# Altium schematic sheet Sensors.SchDoc
size B; SheetNumber: 8; SheetTotal: 8
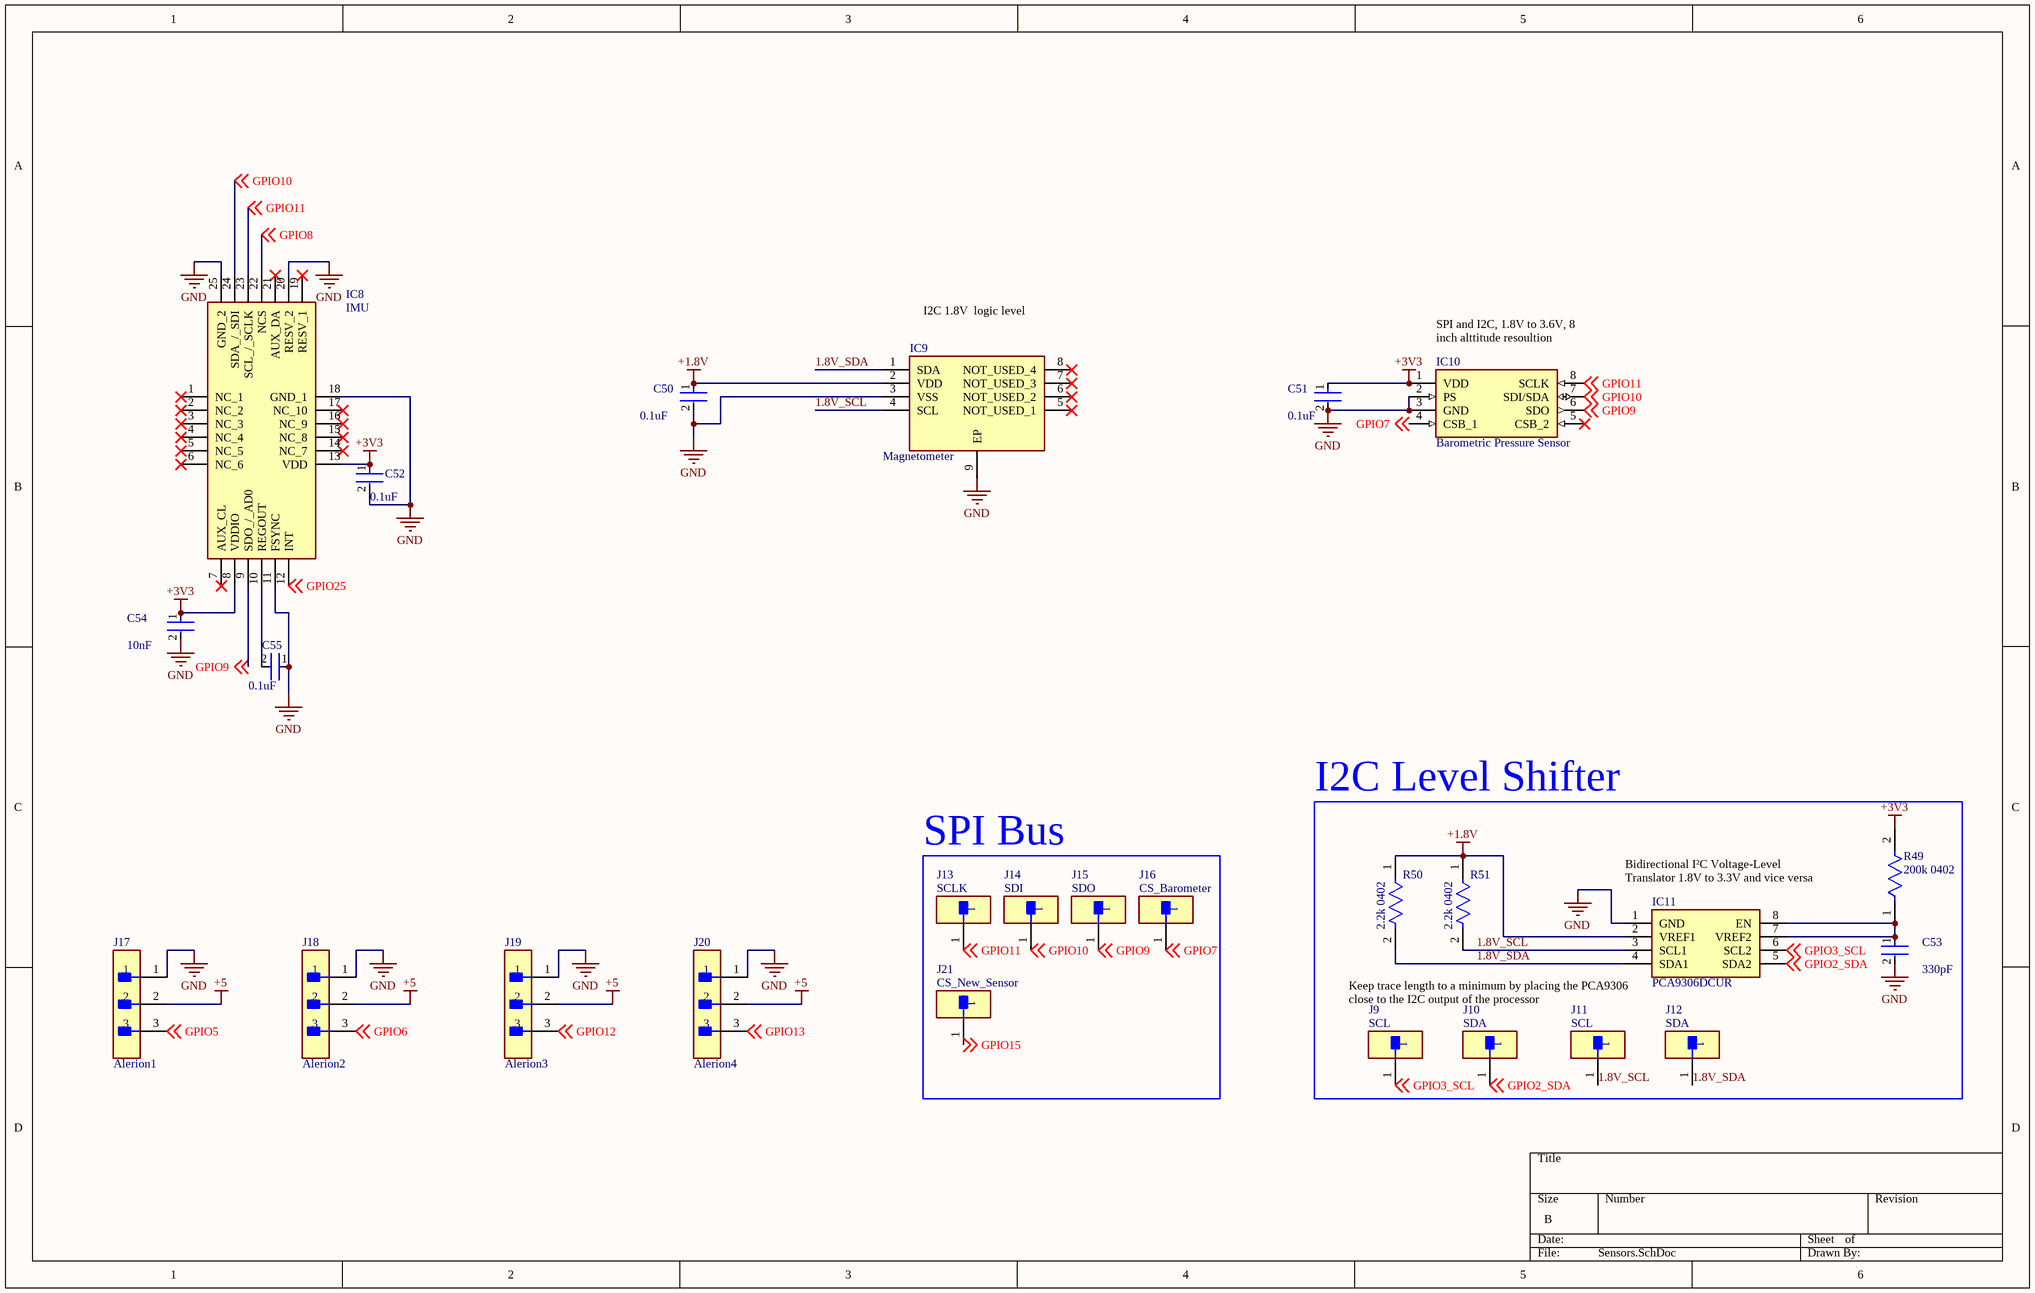
[diagram p0: Sensors.SchDoc]

## Parts
C50  0.1uF  [FP-C0402-BB-MFG]
C51  0.1uF  [FP-C0402-BB-MFG]
C52  0.1uF  [FP-C0402-BB-MFG]
C53  330pF  [FP-C0402-BB-MFG]
C54  10nF  [FP-C0402-BB-MFG]
C55  0.1uF  [FP-C0402-BB-MFG]
IC8  IMU  [QFN40P300X300X95-25N-D]
IC9  Magnetometer  [SON40P250X200X40-9N-D]
IC10  Barometric Pressure Sensor  [MS5607-02BA03]
IC11  PCA9306DCUR  [SOP50P310X90-8N]
J9  SCL  [FP-5015-MFG]
J10  SDA  [FP-5015-MFG]
J11  SCL  [FP-5015-MFG]
J12  SDA  [FP-5015-MFG]
J13  SCLK  [FP-5015-MFG]
J14  SDI  [FP-5015-MFG]
J15  SDO  [FP-5015-MFG]
J16  CS_Barometer  [FP-5015-MFG]
J17  Alerion1  [FP-TSW-103-14-G-S-MFG]
J18  Alerion2  [FP-TSW-103-14-G-S-MFG]
J19  Alerion3  [FP-TSW-103-14-G-S-MFG]
J20  Alerion4  [FP-TSW-103-14-G-S-MFG]
J21  CS_New_Sensor  [FP-5015-MFG]
R49  200k 0402  [FP-RMCF0402-MFG]
R50  2.2k 0402  [FP-RMCF0402-MFG]
R51  2.2k 0402  [FP-RMCF0402-MFG]

## Blocks framed on the sheet
I2C Level Shifter: C53 IC11 J9-J12 R49-R51
SPI Bus: J13-J16 J21

## Nets
+1.8V: C50.1 IC9.2(VDD) IC11.2(VREF1) R50.1 R51.1
+3V3: C51.1 C52.1 C54.1 IC8.8(VDDIO) IC8.13(VDD) IC10.1(VDD) R49.2
+5: J17.2 J18.2 J19.2 J20.2
GND: C50.2 C51.2 C52.2 C53.2 C54.2 C55.1 IC8.11(FSYNC) IC8.18(GND_1) IC8.20(RESV_2) IC8.25(GND_2) IC9.3(VSS) IC9.9(EP) IC10.2(PS) IC10.3(GND) IC11.1(GND) J17.1 J18.1 J19.1 J20.1
1.8V_SCL: IC9.4(SCL) IC11.3(SCL1) J11.1 R51.2
1.8V_SDA: IC9.1(SDA) IC11.4(SDA1) J12.1 R50.2
GPIO2_SDA: IC11.5(SDA2) J10.1 ; off-sheet GPIO2_SDA
GPIO3_SCL: IC11.6(SCL2) J9.1 ; off-sheet GPIO3_SCL
GPIO5: J17.3 ; off-sheet GPIO5
GPIO6: J18.3 ; off-sheet GPIO6
GPIO7: IC10.4(CSB_1) J16.1 ; off-sheet GPIO7
GPIO8: IC8.22(NCS) ; off-sheet GPIO8
GPIO9: IC8.9(SDO_/_AD0) IC10.6(SDO) J15.1 ; off-sheet GPIO9
GPIO10: IC8.24(SDA_/_SDI) IC10.7(SDI/SDA) J14.1 ; off-sheet GPIO10
GPIO11: IC8.23(SCL_/_SCLK) IC10.8(SCLK) J13.1 ; off-sheet GPIO11
GPIO12: J19.3 ; off-sheet GPIO12
GPIO13: J20.3 ; off-sheet GPIO13
GPIO15: J21.1 ; off-sheet GPIO15
GPIO25: IC8.12(INT) ; off-sheet GPIO25
NetC53_1: C53.1 IC11.7(VREF2) IC11.8(EN) R49.1
NetC55_2: C55.2 IC8.10(REGOUT)

Not connected (* = marked no-connect by the designer): IC8 1(NC_1)* 2(NC_2)* 3(NC_3)* 4(NC_4)* 5(NC_5)* 6(NC_6)* 7(AUX_CL)* 14(NC_7)* 15(NC_8)* 16(NC_9)* 17(NC_10)* 19(RESV_1)* 21(AUX_DA)*; IC9 5(NOT_USED_1)* 6(NOT_USED_2)* 7(NOT_USED_3)* 8(NOT_USED_4)*; IC10 5(CSB_2)*

## Notes on the sheet
- (near IC9) I2C 1.8V  logic level
- (near IC10) SPI and I2C, 1.8V to 3.6V, 8 inch alttitude resoultion
- (near IC11) Bidirectional I²C Voltage-Level Translator 1.8V to 3.3V and vice versa
- (near IC11) Keep trace length to a minimum by placing the PCA9306 close to the I2C output of the processor

## Library data of the parts
C50-C52 C55 = CMP-03020-014070-2: C307331; Manufacturer: Kemet; Manufacturer Part Number: C0402C104M3PAC7867; Material: Ceramic; Tolerance: 0.2; Temperature Characteristic: X5R; Value: 0.10 μF; Temperature Coefficient: 15%; Voltage Rating: 25 V; Height: 0.55mm; Category: Cap; Temperature: -55°C to +125°C; Automotive: No; Package: C0402-BB; Temperature Range Low: -55°C; ComponentLink2Description: Datasheet; Device Class L3: Ceramic Capacitors; ComponentLink2URL: https://content.kemet.com/datasheets/KEM_C1002_X7R_SMD.pdf; Octopart: https://octopart.com/c0402c104m3pac7867-kemet-84304880; RoHS: TRUE; Temperature Range High: +125°C; Device Class L1: Passive Components; Capacitance: 0.10 μF; Lead Free: Yes; Ipc Land Pattern Name: CAPC10050X50; Device Class L2: Capacitors; Digikey Description: CAP CER 0.1UF 25V X5R 0402
C53 = CMP-03020-014070-2: C13533; Manufacturer: Kemet; Manufacturer Part Number: C0402C104M3PAC7867; Material: Ceramic; Tolerance: 0.2; Temperature Characteristic: X5R; Value: 0.10 μF; Temperature Coefficient: 15%; Voltage Rating: 25 V; Height: 0.55mm; Category: Cap; Temperature: -55°C to +125°C; Automotive: No; Package: C0402-BB; Temperature Range Low: -55°C; ComponentLink2Description: Datasheet; Device Class L3: Ceramic Capacitors; ComponentLink2URL: https://content.kemet.com/datasheets/KEM_C1002_X7R_SMD.pdf; Octopart: https://octopart.com/c0402c104m3pac7867-kemet-84304880; RoHS: TRUE; Temperature Range High: +125°C; Device Class L1: Passive Components; Capacitance: 0.10 μF; Lead Free: Yes; Ipc Land Pattern Name: CAPC10050X50; Device Class L2: Capacitors; Digikey Description: CAP CER 0.1UF 25V X5R 0402
C54 = CMP-03020-014070-2: C15195; Manufacturer: Kemet; Manufacturer Part Number: C0402C104M3PAC7867; Material: Ceramic; Tolerance: 0.2; Temperature Characteristic: X5R; Value: 0.10 μF; Temperature Coefficient: 15%; Voltage Rating: 25 V; Height: 0.55mm; Category: Cap; Temperature: -55°C to +125°C; Automotive: No; Package: C0402-BB; Temperature Range Low: -55°C; ComponentLink2Description: Datasheet; Device Class L3: Ceramic Capacitors; ComponentLink2URL: https://content.kemet.com/datasheets/KEM_C1002_X7R_SMD.pdf; Octopart: https://octopart.com/c0402c104m3pac7867-kemet-84304880; RoHS: TRUE; Temperature Range High: +125°C; Device Class L1: Passive Components; Capacitance: 0.10 μF; Lead Free: Yes; Ipc Land Pattern Name: CAPC10050X50; Device Class L2: Capacitors; Digikey Description: CAP CER 0.1UF 25V X5R 0402
IC8 = MPU-6500: C50278; Manufacturer_Name: TDK; Datasheet Link: https://product.tdk.com/system/files/dam/doc/product/sensor/mortion-inertial/imu/data_sheet/mpu-6500-datasheet2.pdf; Height: 0.95mm; Manufacturer_Part_Number: MPU-6500; Mouser Part Number: 410-MPU-6500; Mouser Price/Stock: https://www.mouser.co.uk/ProductDetail/TDK-InvenSense/MPU-6500?qs=u4fy%2FsgLU9PiIOIlWOSPhQ%3D%3D; Arrow Part Number: MPU-6500; Arrow Price/Stock: https://www.arrow.com/en/products/mpu-6500/invensense?utm_currency=USD&region=europe
IC9 = MLX90392ELQ-AAA-011-RE: C17495733 / Digikey Replacment Part Just in Case: MLX90392ELQ-AAA-010-RE (10X finer resolution); Manufacturer_Name: Melexis; Datasheet Link: https://media.melexis.com/-/media/files/documents/datasheets/mlx90392-datasheet-melexis.pdf; Height: 0.4mm; Manufacturer_Part_Number: MLX90392ELQ-AAA-011-RE; Mouser Part Number: 482-90392ELQAAA011RE; Mouser Price/Stock: https://www.mouser.co.uk/ProductDetail/Melexis/MLX90392ELQ-AAA-011-RE?qs=DRkmTr78QAR2mFb3EZGuDA%3D%3D; LCSC: C17495733
IC10 = MS560702BA03-50: C97627; Manufacturer_Name: TE Connectivity; Datasheet Link: https://www.te.com/commerce/DocumentDelivery/DDEController?Action=srchrtrv&DocNm=MS5607-02BA03&DocType=Data%20Sheet&DocLang=English&PartCntxt=MS560702BA03-50&DocFormat=pdf; Manufacturer_Part_Number: MS560702BA03-50; Mouser Part Number: 824-MS560702BA03-50; Mouser Price/Stock: https://www.mouser.co.uk/ProductDetail/Measurement-Specialties/MS560702BA03-50?qs=urSpXqmdEVImCZG1H%252BT8ng%3D%3D; Arrow Part Number: MS560702BA03-50; Arrow Price/Stock: https://www.arrow.com/en/products/ms560702ba03-50/te-connectivity?utm_currency=USD&region=europe
IC11 = PCA9306DCUR: C33196; Manufacturer_Name: Texas Instruments; Datasheet Link: http://www.ti.com/lit/gpn/pca9306; Height: 0.9mm; Manufacturer_Part_Number: PCA9306DCUR; Mouser Part Number: 595-PCA9306DCUR; Mouser Price/Stock: https://www.mouser.co.uk/ProductDetail/Texas-Instruments/PCA9306DCUR?qs=wgAEGBTxy7nQr5PRxNBUNA%3D%3D; Arrow Part Number: PCA9306DCUR; Arrow Price/Stock: https://www.arrow.com/en/products/pca9306dcur/texas-instruments?region=nac
J9-J16 J21 = CMP-2000-05183-2: PC TEST POINT MINIATURE; Manufacturer Part Number: 5015; Manufacturer: keystone; Number Of Contacts: 1; Conn Orientation: Straight; Category: Conn; Digikey Description: PC TEST POINT MINIATURE; Automotive: No; Lead Free: Yes; Octopart: https://octopart.com/5015-keystone-3822; ComponentLink2URL: http://www.keyelco.com/product-pdf.cfm?p=1353; Package: 5015; RoHS: TRUE; Device Class L3: unset; Device Class L2: unset; Contact Material: Silver; Device Class L1: Connectors; Height: 1.65mm; ComponentLink2Description: Datasheet
J17-J20 = CMP-02766-001743-1: CONN HEADER VERT 3POS 2.54MM; Max Voltage Rating (AC): 550V; Number of Positions: 3; Max Current Rating: 7.6A; Gender: Male; Termination: Solder; RoHS Compliant: Yes; Mount: Through Hole; Lead Free: Lead Free; Connector Type: Header; REACH SVHC: No SVHC; Insulation Color: Black; Width: 2.54mm; Length: 7.62mm; Flammability Rating: UL94 V-0; Housing Material: Polyester; Contact Material: Bronze; Max Operating Temperature: 125°C; Fastening Type: Pull; Series: TSW; Number of Contacts: 3; Packaging: Bulk; Min Operating Temperature: -55°C; Package Quantity: 1; Height: 10.67mm; Pitch: 2.54mm; Contact Finish - Mating: GOLD; Contact Type: Male Pin; Radiation Hardening: No; Color: Black; Housing Color: Black; Contact Plating: Gold; Orientation: Straight; Number of Rows: 1; Depth: 2.54mm; Insulation Material: PBT; Contact Mating Length: 0.32inch; Contact Shape: Square
R49 = CMP-26527-002093-1: C25764; Max Power Dissipation: 63mW; Tolerance: 5%; Resistance: 3.9R; Temperature Coefficient: 200ppm/°C; Case/Package: 0402; Number of Terminations: 2; Min Operating Temperature: -55°C; Height: 0.016inch; Packaging: Tape and Reel; Resistor Type: Thick Film; Length: 0.039inch; Mount: Surface Mount; Series: RMCF; Max Operating Temperature: 155°C; Contact Plating: Tin; Features: Automotive AEC-Q200; Width: 0.02inch; Radiation Hardening: No; RoHS Compliant: Yes
R50 R51 = CMP-26527-002093-1: C25879; Max Power Dissipation: 63mW; Tolerance: 5%; Resistance: 3.9R; Temperature Coefficient: 200ppm/°C; Case/Package: 0402; Number of Terminations: 2; Min Operating Temperature: -55°C; Height: 0.016inch; Packaging: Tape and Reel; Resistor Type: Thick Film; Length: 0.039inch; Mount: Surface Mount; Series: RMCF; Max Operating Temperature: 155°C; Contact Plating: Tin; Features: Automotive AEC-Q200; Width: 0.02inch; Radiation Hardening: No; RoHS Compliant: Yes